# EAGLE design motorconnect (EAGLE 6.5.0)
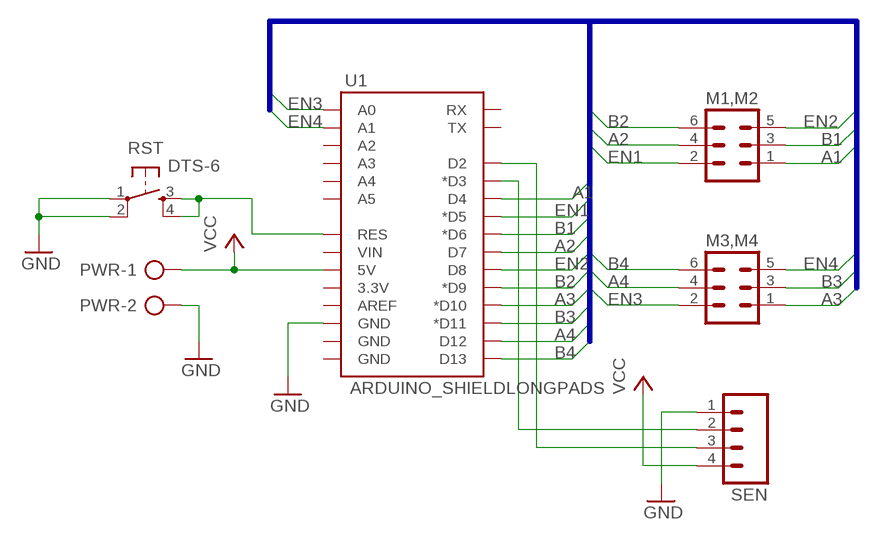
[diagram p0: schematic, sheet 1]

## Parts
M1,M2  ML6  [ML6]
M3,M4  ML6  [ML6]
PWR  AK500/2  [AK500/2]
RST  DTS-6  [DTS-6]
SEN  M04LONGPADS  [1X04_LONGPADS]
U1  ARDUINO_SHIELDLONGPADS  [DUEMILANOVE_SHIELD_LONGPADS]

## Nets
A1: M1,M2.1 U1.D4
A2: M1,M2.4 U1.D7
A3: M3,M4.1 U1.D10(*D10)
A4: M3,M4.4 U1.D12
B1: M1,M2.3 U1.D6(*D6)
B2: M1,M2.6 U1.D9(*D9)
B3: M3,M4.3 U1.D11(*D11)
B4: M3,M4.6 U1.D13
EN1: M1,M2.2 U1.D5(*D5)
EN2: M1,M2.5 U1.D8
EN3: M3,M4.2 U1.A0
EN4: M3,M4.5 U1.A1
GND: PWR.2 RST.1 RST.2 SEN.1 U1.GND@2(GND)
N$1: SEN.2 U1.D3(*D3)
N$2: SEN.3 U1.D2
N$3: RST.3 RST.4 U1.RES
VCC: PWR.1 SEN.4 U1.5V
Unconnected: U1.3.3V U1.A2 U1.A3 U1.A4 U1.A5 U1.AREF U1.GND@0(GND) U1.GND@1(GND) U1.RX U1.TX U1.VIN

## Buses
BUS:A1,EN1,B1,A2,EN2,B2,A3,EN3,B3,A4,EN4,B4

## Library data of the parts
M1,M2 M3,M4 = con-harting-ml:ML6: HARTING; OC_FARNELL: unknown; OC_NEWARK: unknown
PWR = con-ptr500:AK500/2: CONNECTOR; OC_FARNELL: unknown; OC_NEWARK: unknown
RST = switch-tact:DTS-6
SEN = SparkFun-Connectors:M04: Header 4 Standard 4-pin 0.1" header. Use with straight break away headers (SKU : PRT-00116), right angle break away headers (PRT-00553), swiss pins (PRT-00743), machine pins (PRT-00117), and female headers (PRT-00115). Molex polarized connector foot print use with SKU : PRT-08231 with associated crimp pins and housings. 1MM SMD Version SKU: PRT-10208
U1 = SparkFun-Boards:ARDUINO_SHIELD: Arduino shield footprint

## Board
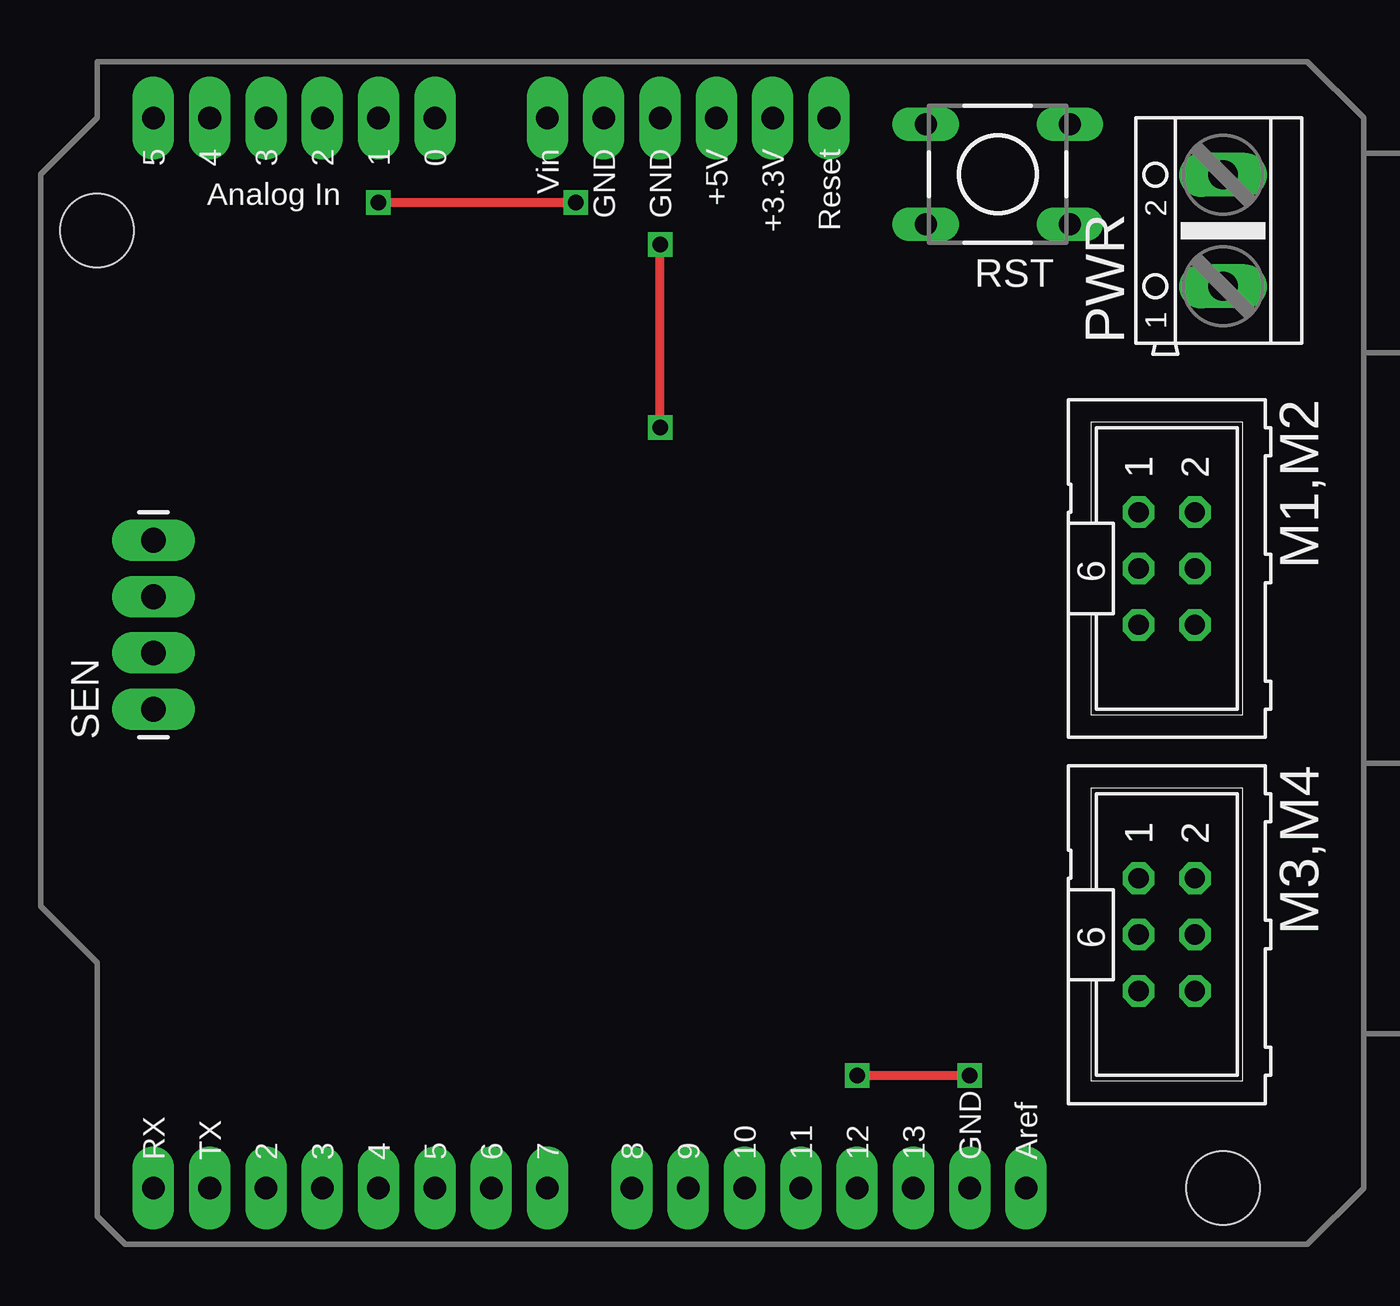
[diagram p1: board, top side]
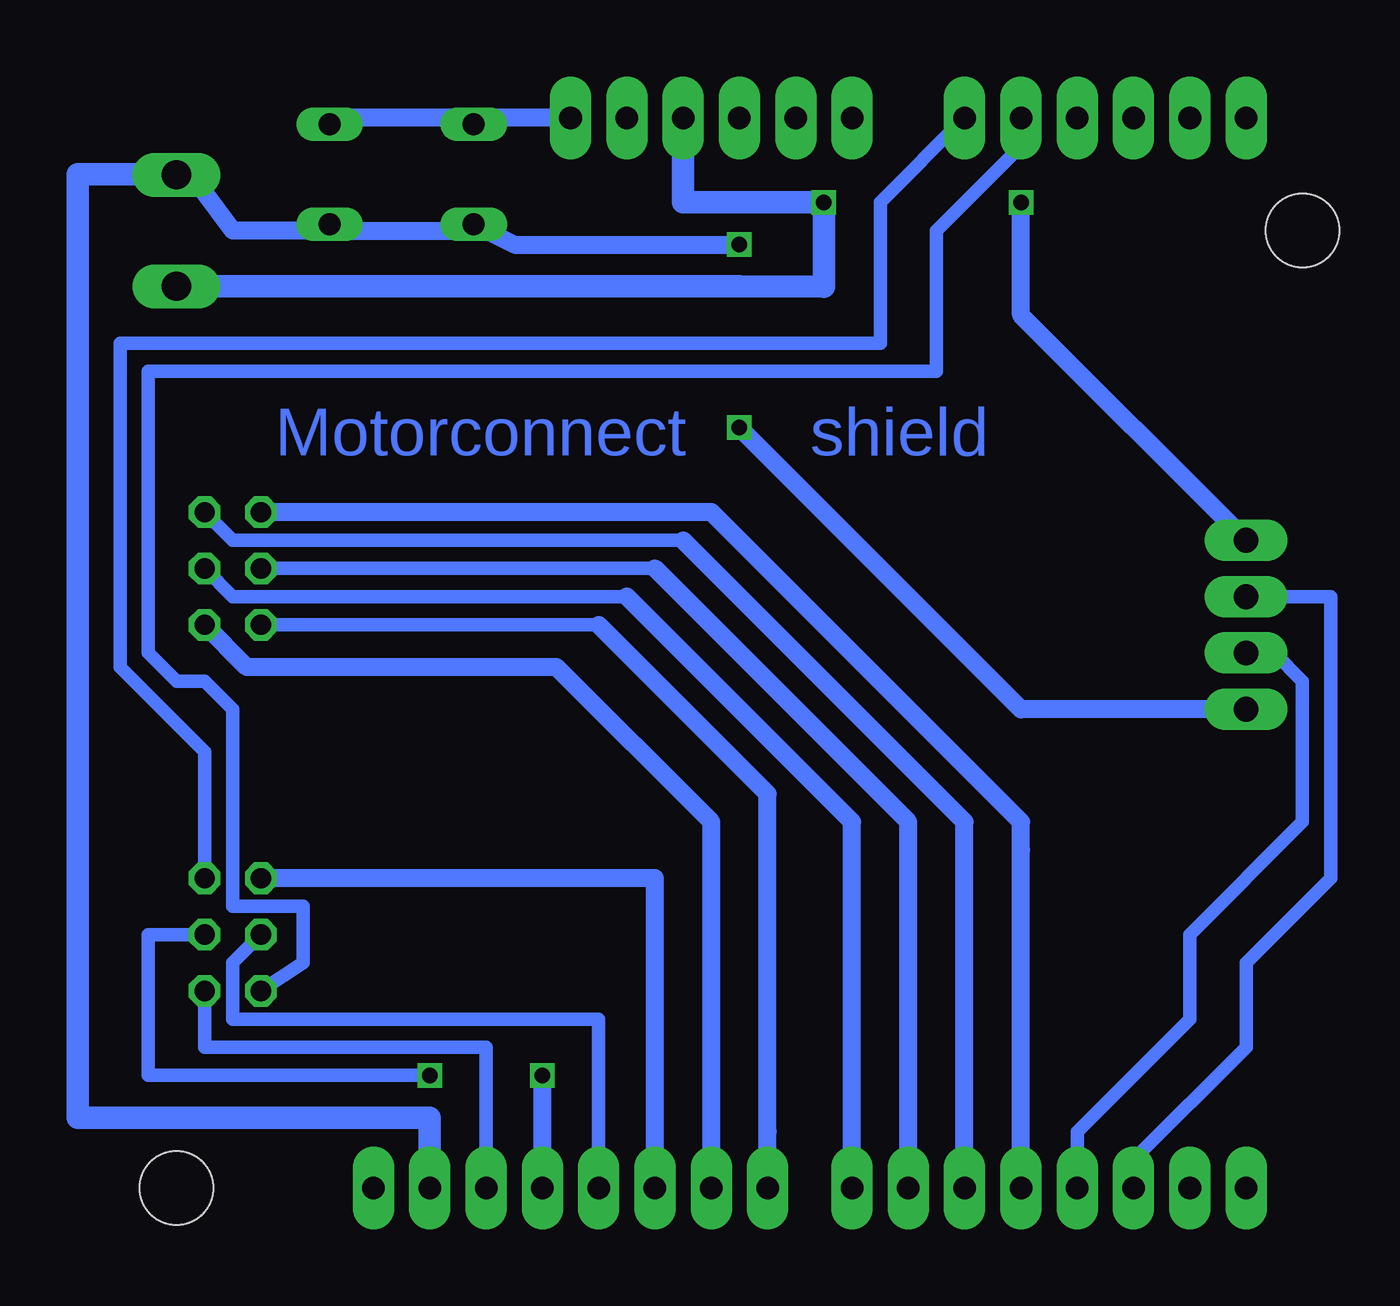
[diagram p2: board, bottom side, seen from below]

No outline drawn. Coordinates in mm, seen from the top.
Copper layers (1*16): Top 0.035mm / dielectric 1.5mm / Bottom 0.035mm
Design rules "default": minimum track width 10mil, minimum drill 24mil, track to track 8mil, track to pad 8mil, pad to pad 8mil, via to via 8mil, smd to smd 8mil, copper to edge 40mil, drill to drill 8mil, minimum pad ring 10mil, minimum via ring 8mil, stop-mask expansion 4mil, vias tented up to drill 0mil, thermal gap 10mil

### Footprints (pad centres in the part's own frame; a part is rotated, then mirrored left to right if it is on the bottom)
ML6 = drill 0.914 octagon: 1 -2.54,-1.27; 2 -2.54,1.27; 3 0,-1.27; 4 0,1.27; 5 2.54,-1.27; 6 2.54,1.27
AK500/2 = drill 1.321 long: 1 -2.515,0; 2 2.515,0
DTS-6 = drill 1 long: 1 -3.25,2.25; 2 3.25,2.25; 3 -3.25,-2.25; 4 3.25,-2.25
1X04_LONGPADS = drill 1.118 pad 1.88 long: 1 0,0; 2 2.54,0; 3 5.08,0; 4 7.62,0
DUEMILANOVE_SHIELD_LONGPADS = drill 1.016 pad 1.88 long: 3.3V 50.8,26.67; 5V 50.8,29.21; A0 50.8,41.91; A1 50.8,44.45; A2 50.8,46.99; A3 50.8,49.53; A4 50.8,52.07; A5 50.8,54.61; AREF 2.54,15.24; D2 2.54,49.53; D3 2.54,46.99; D4 2.54,44.45; D5 2.54,41.91; D6 2.54,39.37; D7 2.54,36.83; D8 2.54,33.02; D9 2.54,30.48; D10 2.54,27.94; D11 2.54,25.4; D12 2.54,22.86; D13 2.54,20.32; GND@0 50.8,31.75; GND@1 50.8,34.29; GND@2 2.54,17.78; RES 50.8,24.13; RX 2.54,54.61; TX 2.54,52.07; VIN 50.8,36.83 | hole 3.302: 45.72,57.15; 2.54,6.35

### Placement (x,y rotation side)
M1,M2  52.07,30.48 270 top
M3,M4  52.07,13.97 270 top
PWR  54.61,45.72 90 top
RST  44.45,48.26 180 top
SEN  6.35,24.13 90 top
U1  60.96,0 90 top

### Tracks (layer width: path | path; a pad name or v marks a point on that pad's centre or on a via)
A1
  Bottom 0.813: M1,M2.1 45.72,33.02 33.02,33.02 30.48,33.02 16.51,19.05 16.51,17.78 16.51,3.81 U1.D4
A2
  Bottom 0.61: M1,M2.4 52.07,29.21 49.53,29.21 34.29,29.21
  Bottom 0.813: 34.29,29.21 24.13,19.05 24.13,3.81 U1.D7
A3
  Bottom 0.813: U1.D10 33.02,16.51 M3,M4.1
A4  (via drill 0.7 pad 1.02)
  Top 0.406: v38.1,7.62 v43.18,7.62
  Bottom 0.61: v43.18,7.62 55.88,7.62 55.88,13.97 M3,M4.4
  Bottom 0.813: U1.D12 v38.1,7.62
B1
  Bottom 0.61: M1,M2.3 48.26,30.48 33.02,30.48
  Bottom 0.813: 33.02,30.48 21.59,19.05 21.59,3.81 U1.D6
B2
  Bottom 0.813: U1.D9 30.48,19.05 37.47,26.04 51.44,26.04 M1,M2.6
B3
  Bottom 0.61: M3,M4.3 52.07,12.7 52.07,10.16 35.56,10.16 U1.D11
B4
  Bottom 0.61: M3,M4.6 53.34,8.89 40.64,8.89 U1.D13
EN1
  Bottom 0.61: M1,M2.2 52.07,31.75 46.99,31.75 31.75,31.75
  Bottom 0.813: 31.75,31.75 19.05,19.05 19.05,3.81 U1.D5
EN2
  Bottom 0.61: 35.56,27.94 M1,M2.5
  Bottom 0.813: 35.56,27.94 27.94,20.32 27.94,5.08 U1.D8
EN3
  Bottom 0.61: M3,M4.2 53.34,22.23 57.15,26.04 57.15,40.64 22.86,40.64 22.86,46.99 U1.A0
EN4
  Bottom 0.61: M3,M4.5 48.9,12.7 48.9,15.24 52.07,15.24 52.07,24.13 53.34,25.4 54.61,25.4 55.88,26.67 55.88,39.37 20.32,39.37 20.32,45.72 16.51,49.53 U1.A1
GND  (via drill 0.7 pad 1.02)
  Top 0.406: v29.21,36.83 v29.21,45.09
  Bottom 0.254: 41.91,45.72 RST.2 | 46.99,45.72 RST.1 48.26,45.72 | 53.98,48.26 PWR.2
  Bottom 0.813: 46.99,45.72 41.91,45.72 | 53.98,48.26 52.07,45.72 48.26,45.72 | v29.21,45.09 39.37,45.09 RST.2 | 43.18,3.81 U1.GND@2 | SEN.1 16.51,24.13 v29.21,36.83
  Bottom 1.016: 53.98,48.26 59.05,48.26 59.05,5.71 43.18,5.71 43.18,3.81
N$1
  Bottom 0.61: U1.D3 13.97,5.08 8.89,10.16 8.89,13.97 3.81,19.05 3.81,25.4 5.08,26.67 SEN.2
N$2
  Bottom 0.61: U1.D2 11.43,3.81 6.35,8.89 6.35,12.7 2.54,16.51 2.54,29.21 SEN.3
N$3
  Bottom 0.254: 40.64,50.8 RST.4 41.91,50.8 | 46.99,50.8 RST.3
  Bottom 0.813: U1.RES 40.64,50.8 | 41.91,50.8 46.99,50.8
VCC  (via drill 0.7 pad 1.02)
  Top 0.406: v16.51,46.99 v25.4,46.99
  Bottom 0.813: SEN.4 16.51,41.91 v16.51,46.99
  Bottom 1.016: PWR.1 29.21,43.2 25.4,43.18 v25.4,46.99 31.75,46.99 U1.5V

### Text on the board
Bottom: shield | Motorconnect